# Altium schematic sheet Sheet1.SchDoc
size A
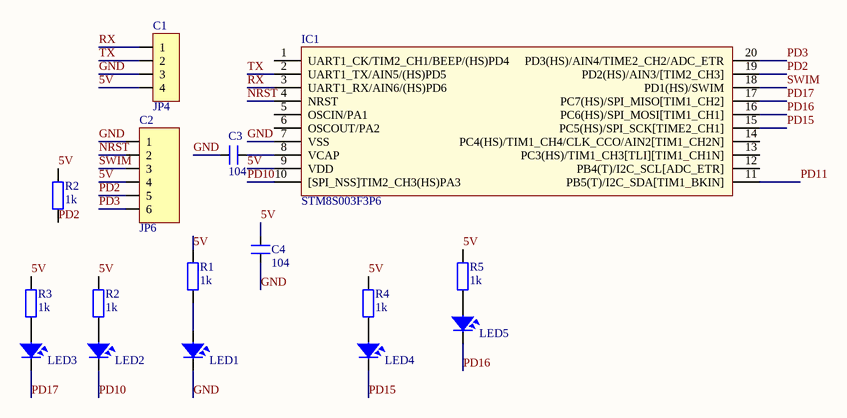
[diagram p0: Sheet1.SchDoc]

## Parts
(Parts that share a designator on the sheet are numbered #1, #2 ... from top to bottom, then left to right.)
C1  JP4  [JP4-C1C]
C2  JP6  [JP6-C1C]
C3  104  [SM-CAP-0805]
C4  104  [SM-CAP-0805]
IC1  STM8S003F3P6  [TSSOP20]
LED1  LED SMD  [SM-LED-0805-Blue]  (value not drawn)
LED2  LED SMD  [SM-LED-0805-Blue]  (value not drawn)
LED3  LED SMD  [SM-LED-0805-Blue]  (value not drawn)
LED4  LED SMD  [SM-LED-0805-Blue]  (value not drawn)
LED5  LED SMD  [SM-LED-0805-Blue]  (value not drawn)
R1  1k  [SM-RES-0805]
R2#1  1k  [SM-RES-0805]
R2#2  1k  [SM-RES-0805]
R3  1k  [SM-RES-0805]
R4  1k  [SM-RES-0805]
R5  1k  [SM-RES-0805]

## Nets
5V: C1.4 C2.4 C4.1 IC1.9(VDD) R1.2 R2#1.2 R2#2.2 R3.2 R4.2 R5.2
GND: C1.3 C2.1 C3.2 C4.2 IC1.7(VSS) LED1.2
NRST: C2.2 IC1.4(NRST)
PD2: C2.5 IC1.19(PD2(HS)/AIN3/[TIM2_CH3]) R2#1.1
PD3: C2.6 IC1.20(PD3(HS)/AIN4/TIME2_CH2/ADC_ETR)
PD10: IC1.10([SPI_NSS]TIM2_CH3(HS)PA3) LED2.2
PD11: IC1.11(PB5(T)/I2C_SDA[TIM1_BKIN])
PD15: IC1.15(PC5(HS)/SPI_SCK[TIME2_CH1]) LED4.2
PD16: IC1.16(PC6(HS)/SPI_MOSI[TIM1_CH1]) LED5.2
PD17: IC1.17(PC7(HS)/SPI_MISO[TIM1_CH2]) LED3.2
RX: C1.1 IC1.3(UART1_RX/AIN6/(HS)PD6)
SWIM: C2.3 IC1.18(PD1(HS)/SWIM)
TX: C1.2 IC1.2(UART1_TX/AIN5/(HS)PD5)
NetC3_1: C3.1 IC1.8(VCAP)
NetLED1_1: LED1.1 R1.1
NetLED2_1: LED2.1 R2#2.1
NetLED3_1: LED3.1 R3.1
NetLED4_1: LED4.1 R4.1
NetLED5_1: LED5.1 R5.1

Not connected (* = marked no-connect by the designer): IC1 1(UART1_CK/TIM2_CH1/BEEP/(HS)PD4) 5(OSCIN/PA1) 6(OSCOUT/PA2) 12(PB4(T)/I2C_SCL[ADC_ETR]) 13(PC3(HS)/TIM1_CH3[TLI][TIM1_CH1N]) 14(PC4(HS)/TIM1_CH4/CLK_CCO/AIN2[TIM1_CH2N])

## Library data of the parts
C1 = JP4: WR-PHD 2.54 mm Angled Socket Header; Manufacturer: W¨¹rth Elektronik eiSos GmbH; partNo: 613004143121; ComponentLink1 Description: Manufacturer; ComponentLink2 Description: Datasheet; NoPins: 04; Created Date: 29 March 2013; ComponentLink1URL: http://www.we-online.com; ComponentLink2URL: http://katalog.we-online.de/em/datasheet/6130xx143121.pdf; Created by: Karrer Zheng
C2 = JP6: WR-PHD 2.54 mm Angled Socket Header; Manufacturer: W¨¹rth Elektronik eiSos GmbH; partNo: 613006143121; ComponentLink1 Description: Manufacturer; ComponentLink2 Description: Datasheet; NoPins: 06; Created Date: 29 March 2013; ComponentLink1URL: http://www.we-online.com; ComponentLink2URL: http://katalog.we-online.de/em/datasheet/6130xx143121.pdf; Created by: Karrer Zheng
C3 C4 = CN: Value: 0,1uF/300V; Designed by: VanDungEvn
IC1 = STM8S003F3P6: MCU 8BIT  8KB FLASH TSSOP-20; Value: 24Cxx; Value: DIP 8; Copyright by: VanDungEvn
LED1-LED5 = LED-SMD-0805
R1 R2#1 R2#2 R3-R5 = R1/4W: Resistor 1/4W; Value: R1/4W - 1K